# Altium project ComparatorV2Prj.PrjPCB
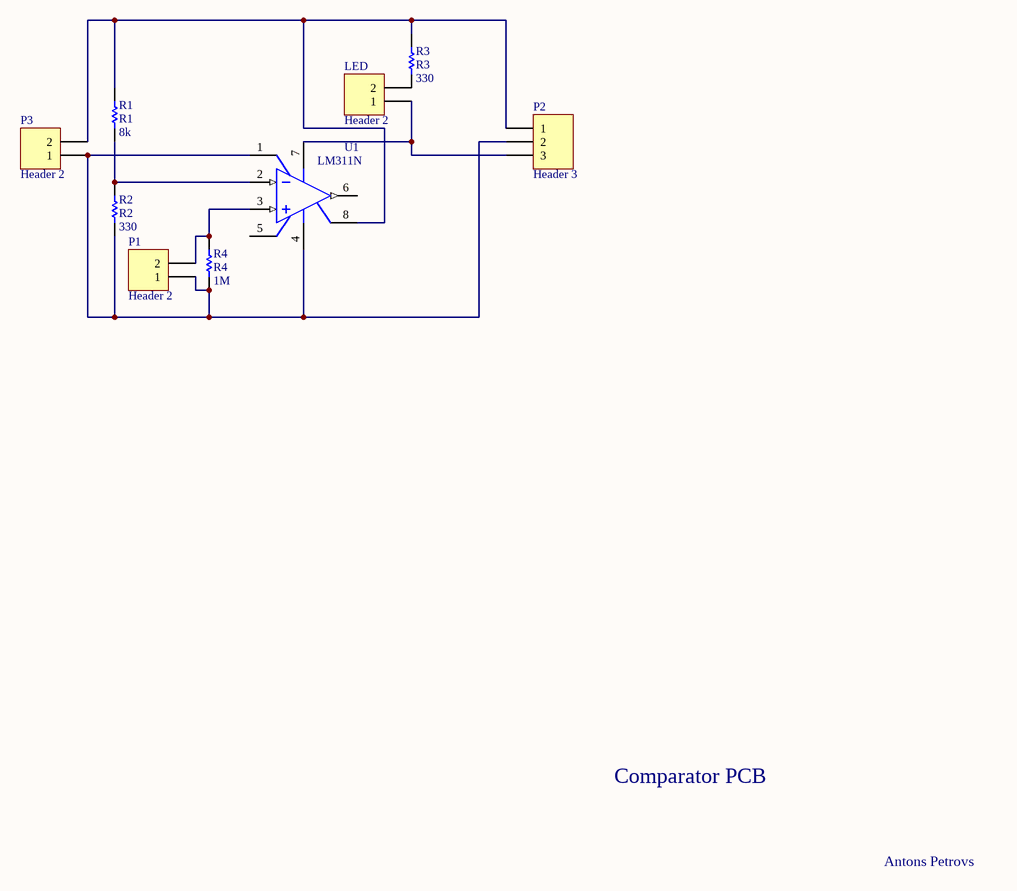
[diagram p0: Sheet2.SchDoc]
1 sheet, 9 parts. Net scope: global (net labels, ports and power ports of the same name join across sheets).
Board file: ComparatorV2.PcbDoc

## Sheet Sheet2.SchDoc
size A4

### Parts
LED  Header 2  [HDR1X2]
P1  Header 2  [HDR1X2]
P2  Header 3  [HDR1X3]
P3  Header 2  [HDR1X2]
R1  R1  value 8k  [AXIAL-0.3]
R2  R2  value 330  [AXIAL-0.3]
R3  R3  value 330  [AXIAL-0.3]
R4  R4  value 1M  [AXIAL-0.3]
U1  LM311N  [N08E]

### Nets
NetLED_1: LED.1 P2.3 U1.7(V+)
NetLED_2: LED.2 R3.1
NetP1_1: P1.1 P2.2 P3.1 R2.1 R4.1 U1.1(OFS_NULL) U1.4(V-)
NetP1_2: P1.2 R4.2 U1.3(IN+)
NetP2_1: P2.1 P3.2 R1.2 R3.2 U1.8(NC)
NetR1_1: R1.1 R2.2 U1.2(IN-)

Not connected (* = marked no-connect by the designer): U1 5(OFS_NULL) 6(OUT)

### Notes on the sheet
- Comparator PCB
- Antons Petrovs

### Library data of the parts
LED P1 P3 = Header 2: Header, 2-Pin; LatestRevisionDate: 17-Jul-2002; LatestRevisionNote: Re-released for DXP Platform.; Publisher: Altium Limited
P2 = Header 3: Header, 3-Pin; LatestRevisionDate: 17-Jul-2002; LatestRevisionNote: Re-released for DXP Platform.; Publisher: Altium Limited
R1-R4 = Res1: Resistor; Published: 8-Jun-2000; LatestRevisionDate: 17-Jul-2002; LatestRevisionNote: Re-released for DXP Platform.; PackageReference: AXIAL-0.3; Publisher: Altium Limited; PackageDescription: Axial Device, Thru-Hole; 2 Leads; 0.3 in Pin Spacing
U1 = LM741CN: Operational Amplifier, 8-pin MDIP; Manufacturer: National Semiconductor; PackageTopMarking: NSUZXYTTE#*LM*741CN; PowerWise: N; CompType: Amplifiers; Published: 4-Dec-2008; LatestRevisionDate: 13-Jan-2009; LatestRevisionNote: Sim Model Added.; DatasheetVersion: Aug-2000; PackageVersion: revG, May-2006; PackageReference: N08E; Publisher: Altium Limited; PackageDescription: MDIP, .365 x .250 x .130in, 8 Lead, .100in Pitch; Supplier 1: Farnell; Supplier Part Number 1: 1523833; Supplier 2: Farnell; Supplier Part Number 2: 9486780; PartNumber: LM741CN; RoHS: N; PinCount: 8; Code_JEDEC: MS-001-BA; ComponentLink1Description: LM741 Datasheet; ComponentLink1URL: http://www.national.com/ds/LM/LM741.pdf; ComponentLink2Description: LM741 Web Page; ComponentLink2URL: http://www.national.com/pf/LM/LM741.html; ComponentLink3Description: N08E Package Page; ComponentLink3URL: http://www.national.com/packaging/folders/n08e.html